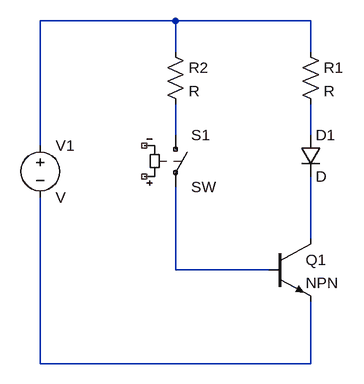
[diagram p0: schematic logic_gates_npn.asc]
logic_gates_npn.asc, the LTspice schematic file:
Version 4
SHEET 1 880 680
WIRE 256 -64 48 -64
WIRE 464 -64 256 -64
WIRE 256 -16 256 -64
WIRE 464 -16 464 -64
WIRE 256 112 256 64
WIRE 464 112 464 64
WIRE 48 128 48 -64
WIRE 464 272 464 176
WIRE 256 320 256 192
WIRE 400 320 256 320
WIRE 48 464 48 208
WIRE 464 464 464 368
WIRE 464 464 48 464
SYMBOL diode 448 112 R0
SYMATTR InstName D1
SYMBOL Res 448 -32 R0
SYMATTR InstName R1
SYMBOL Res 240 -32 R0
SYMATTR InstName R2
SYMBOL Voltage 48 112 R0
SYMATTR InstName V1
SYMBOL sw 256 96 R0
SYMATTR InstName S1
SYMBOL npn 400 272 R0
SYMATTR InstName Q1

The netlist it stands for:
* logic_gates_npn.asc
D1 N003 N004 D
R1 N001 N003 R
R2 N001 N002 R
V1 N001 N006 V
S1 N002 N005 NC_01 NC_02 SW
Q1 N004 N005 N006 0 NPN
.model D D
.lib standard.dio
.model NPN NPN
.model PNP PNP
.lib standard.bjt
.backanno
.end